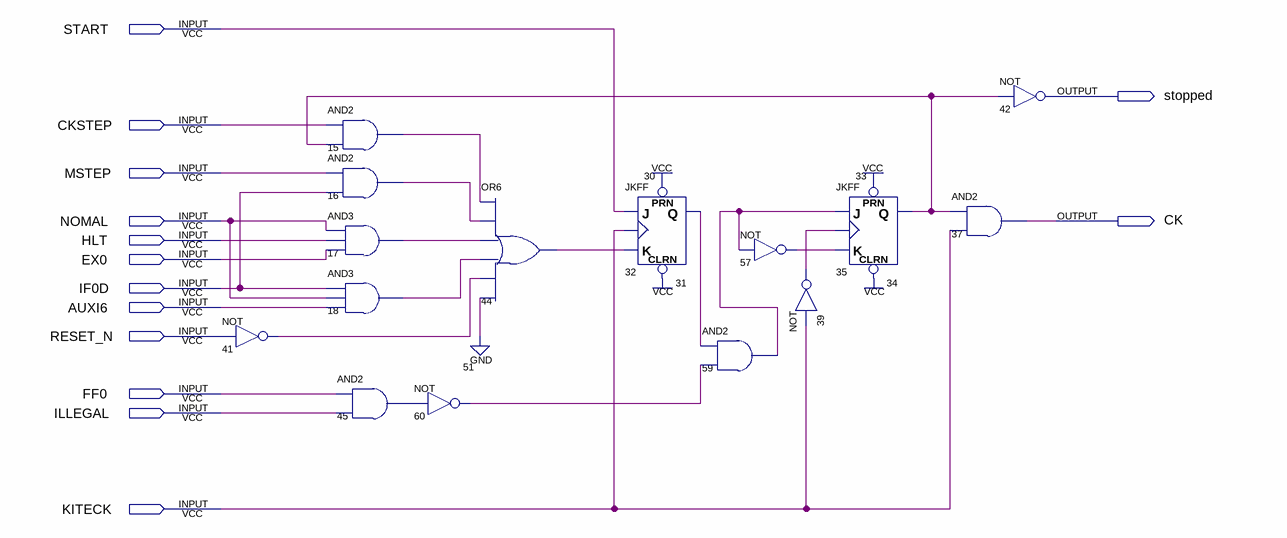
[diagram p0: schematic sheet]
// Quartus schematic run.bdf as structural Verilog: 15 symbols, 14 pins
module run (
  input  START,
  input  CKSTEP,
  input  MSTEP,
  input  NOMAL,
  input  HLT,
  input  EX0,
  input  IF0D,
  input  AUXI6,
  input  RESET_N,
  input  FF0,
  input  ILLEGAL,
  input  KITECK,
  output stopped,
  output CK
);

  wire n15_out, n16_out, n17_out, n18_out, n32_q, n35_q, n39_out, n41_out, n44_out, n45_out, n57_out,
       n59_out, n60_out;

  not u_41 (n41_out, RESET_N);
  and u_15 (n15_out, CKSTEP, n35_q);
  and u_16 (n16_out, MSTEP, IF0D);
  and u_17 (n17_out, NOMAL, HLT, EX0);
  and u_18 (n18_out, IF0D, NOMAL, AUXI6);
  and u_45 (n45_out, FF0, ILLEGAL);
  not u_60 (n60_out, n45_out);
  or u_44 (n44_out, n15_out, n16_out, n17_out, n18_out, n41_out, 1'b0);
  JKFF u_32 (.PRN(1'b1), .CLRN(1'b1), .K(n44_out), .J(START), .CLK(KITECK), .Q(n32_q));
  and u_59 (n59_out, n32_q, n60_out);
  not u_57 (n57_out, n59_out);
  JKFF u_35 (.PRN(1'b1), .CLRN(1'b1), .K(n57_out), .J(n59_out), .CLK(n39_out), .Q(n35_q));
  not u_39 (n39_out, KITECK);
  not u_42 (stopped, n35_q);
  and u_37 (CK, n35_q, KITECK);
endmodule
